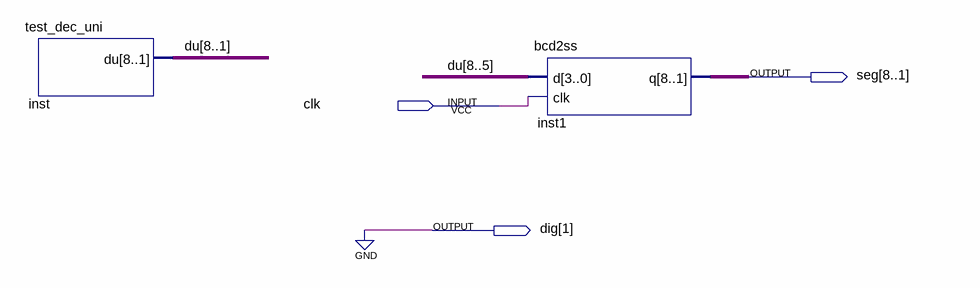
[diagram p0: schematic sheet]
// Quartus schematic test_uni_dec.bdf as structural Verilog: 2 symbols, 3 pins
module test_uni_dec (
  input  clk,
  output [8:1] seg,
  output [1:1] dig
);

  wire [8:1] du;

  test_dec_uni inst (.du(du));
  bcd2ss inst1 (.d(du[8:5]), .clk(clk), .q(seg));

  assign dig[1] = 1'b0;
endmodule
